# EAGLE design Pendulum Lamp PCB (EAGLE 8.6.0)

## Sheet 1 of 2
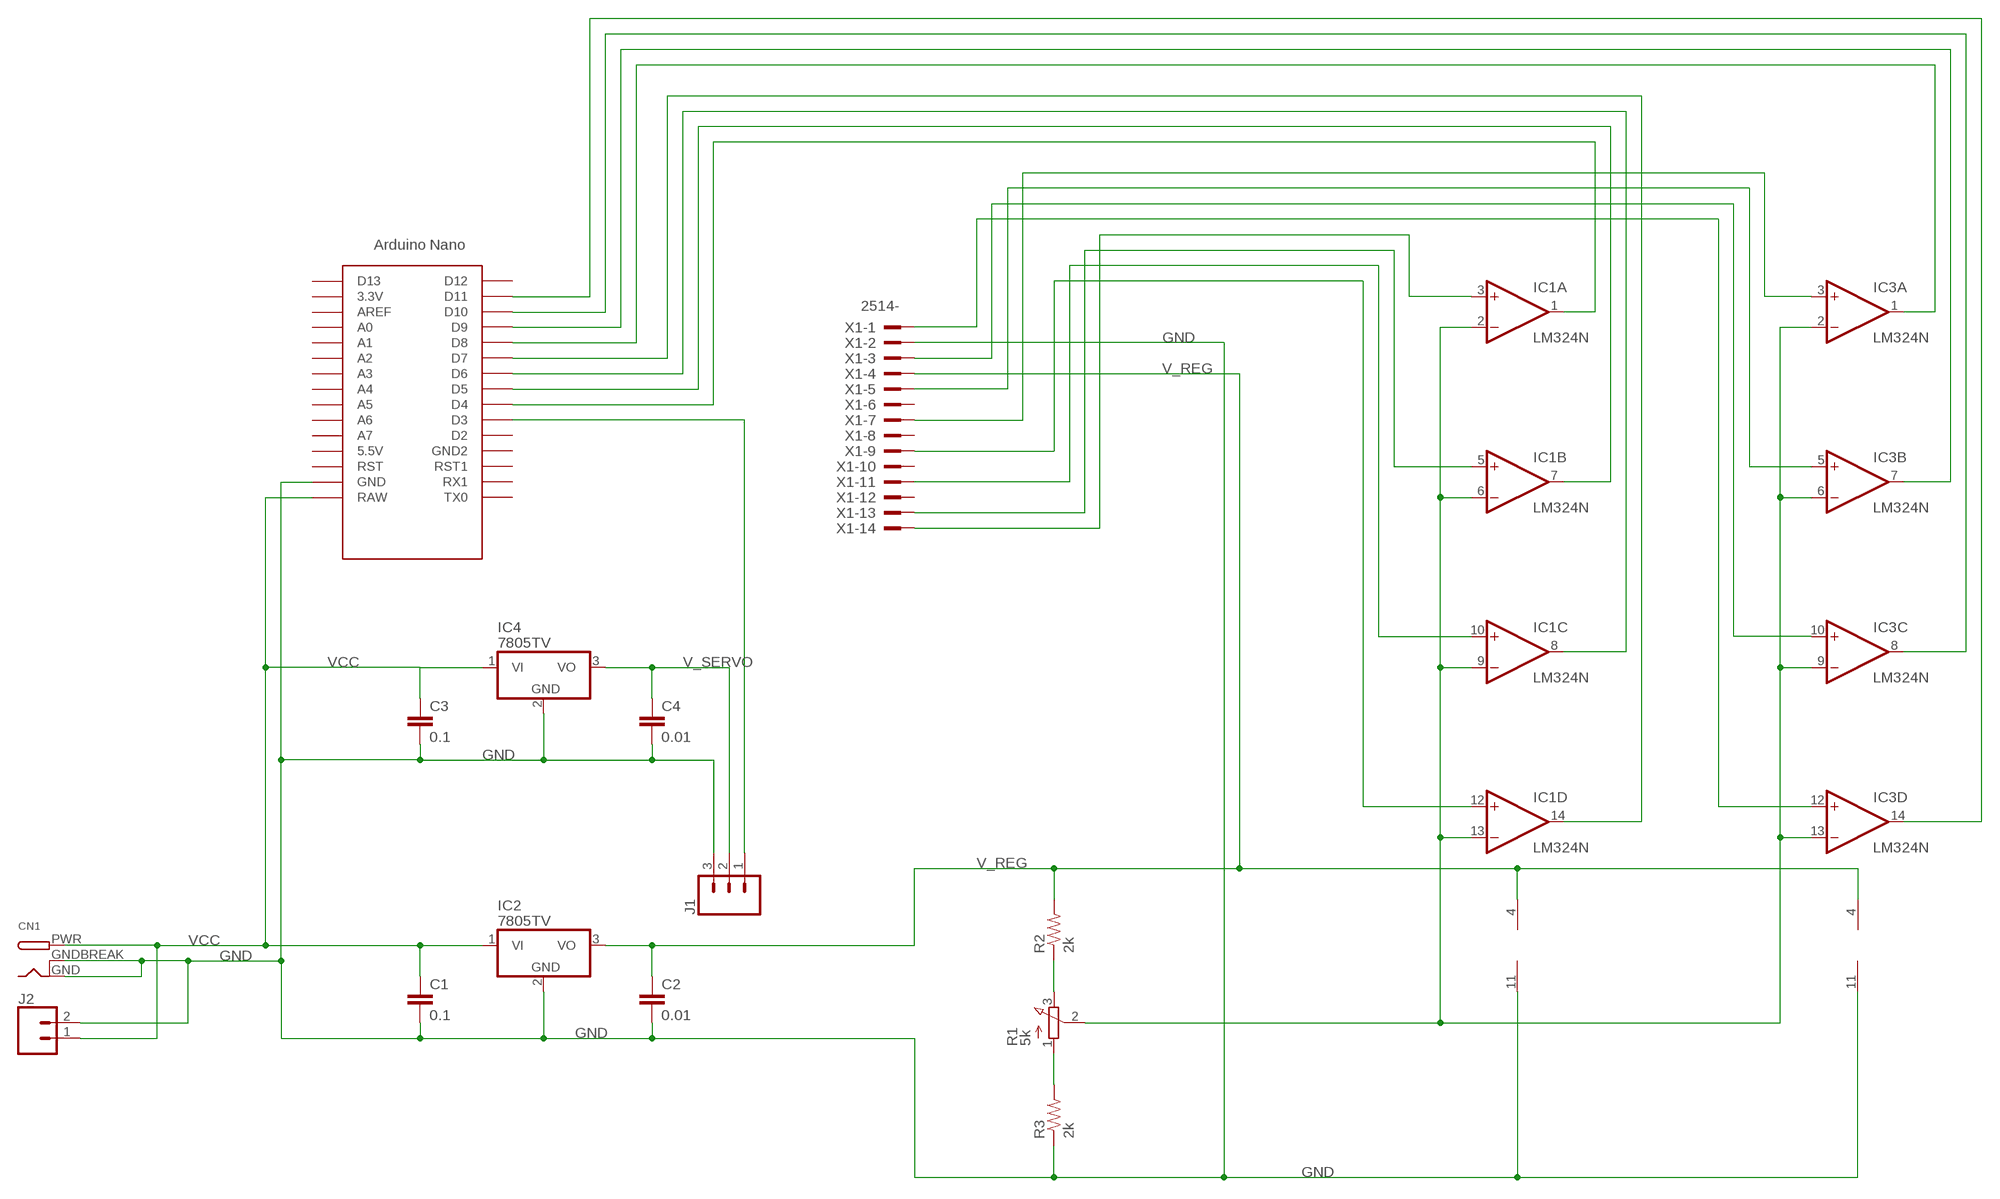
[diagram p0: schematic, sheet 1]

### Parts
C1  0.1  C-EU025-030X050  [C025-030X050]
C2  0.01  C-EU025-030X050  [C025-030X050]
C3  0.1  C-EU025-030X050  [C025-030X050]
C4  0.01  C-EU025-030X050  [C025-030X050]
CN1  DCBARRELPTH  [DCJACK_2MM_PTH]
IC1  LM324N  [DIL14]
IC2  7805TV  [TO220V]
IC3  LM324N  [DIL14]
IC4  7805TV  [TO220V]
J1  CONN_03LONGPADS  [1X03_LONGPADS]
J2  CONN_023.5MM_LOCK  [SCREWTERMINAL-3.5MM-2_LOCK]
R1  5k  3RP/1610N  [3RP/1610N]
R2  2k  R-US_0204/7  [0204/7]
R3  2k  R-US_0204/7  [0204/7]
U$1  NANO  [NANO]
X1  2514-  [PAK100/2500-14]

### Nets
GND: C1.2 C2.2 C3.2 C4.2 CN1.GND CN1.GNDBREAK IC1.11(P:V-) IC2.2(GND) IC3.11(P:V-) IC4.2(GND) J1.3 J2.2 R3.1 U$1.GND X1.2
N$1: IC1.3(A:+IN) X1.14
N$2: IC3.5(B:+IN) X1.5
N$3: J1.1 U$1.D3
N$4: IC3.10(C:+IN) X1.3
N$5: R1.1(A) R3.2
N$6: R1.3(E) R2.1
N$7: IC1.2(A:-IN) IC1.6(B:-IN) IC1.9(C:-IN) IC1.13(D:-IN) IC3.2(A:-IN) IC3.6(B:-IN) IC3.9(C:-IN) IC3.13(D:-IN) R1.2(S)
N$8: IC1.1(A:OUT) U$1.D4
N$9: IC1.7(B:OUT) U$1.D5
N$10: IC1.8(C:OUT) U$1.D6
N$11: IC1.14(D:OUT) U$1.D7
N$12: IC3.1(A:OUT) U$1.D8
N$13: IC3.7(B:OUT) U$1.D9
N$14: IC3.8(C:OUT) U$1.D10
N$15: IC3.14(D:OUT) U$1.D11
N$16: IC3.12(D:+IN) X1.1
N$17: IC1.12(D:+IN) X1.9
N$18: IC1.5(B:+IN) X1.13
N$19: IC1.10(C:+IN) X1.11
N$21: IC3.3(A:+IN) X1.7
V_REG: C2.1 IC1.4(P:V+) IC2.3(VO) IC3.4(P:V+) R2.2 X1.4
V_SERVO: C4.1 IC4.3(VO) J1.2
VCC: C1.1 C3.1 CN1.PWR IC2.1(VI) IC4.1(VI) J2.1 U$1.RAW
Unconnected: U$1.3.3V U$1.5V(5.5V) U$1.A0 U$1.A1 U$1.A2 U$1.A3 U$1.A4 U$1.A5 U$1.A6 U$1.A7 U$1.AREF U$1.D2 U$1.D12 U$1.D13 U$1.GND1(GND2) U$1.ICSP1 U$1.ICSP2 U$1.ICSP3 U$1.ICSP4 U$1.ICSP5 U$1.ICSP6 U$1.RST U$1.RST1 U$1.RX1 U$1.TX0 X1.6 X1.8 X1.10 X1.12

## Sheet 2 of 2
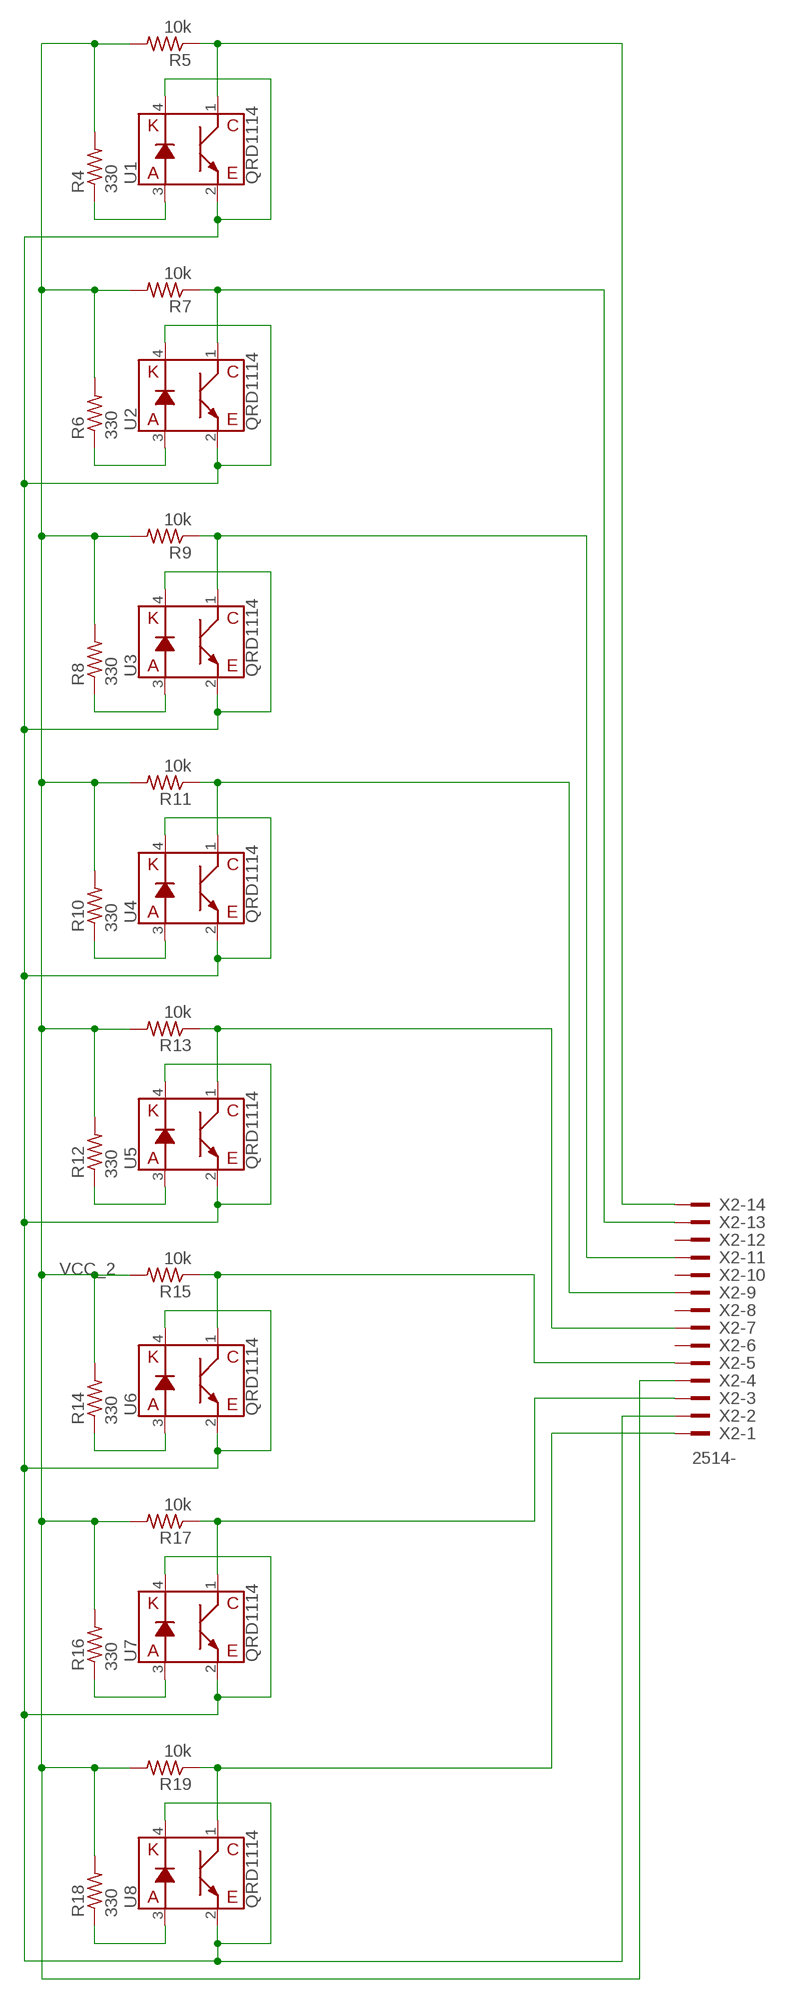
[diagram p1: schematic, sheet 2]

### Parts
R4  330  R-US_0204/7  [0204/7]
R5  10k  R-US_0204/7  [0204/7]
R6  330  R-US_0204/7  [0204/7]
R7  10k  R-US_0204/7  [0204/7]
R8  330  R-US_0204/7  [0204/7]
R9  10k  R-US_0204/7  [0204/7]
R10  330  R-US_0204/7  [0204/7]
R11  10k  R-US_0204/7  [0204/7]
R12  330  R-US_0204/7  [0204/7]
R13  10k  R-US_0204/7  [0204/7]
R14  330  R-US_0204/7  [0204/7]
R15  10k  R-US_0204/7  [0204/7]
R16  330  R-US_0204/7  [0204/7]
R17  10k  R-US_0204/7  [0204/7]
R18  330  R-US_0204/7  [0204/7]
R19  10k  R-US_0204/7  [0204/7]
U1  QRD1114  [QRD1114]
U2  QRD1114  [QRD1114]
U3  QRD1114  [QRD1114]
U4  QRD1114  [QRD1114]
U5  QRD1114  [QRD1114]
U6  QRD1114  [QRD1114]
U7  QRD1114  [QRD1114]
U8  QRD1114  [QRD1114]
X2  2514-  [PAK100/2500-14]

### Nets
GND_2: U1.2(E) U1.4(K) U2.2(E) U2.4(K) U3.2(E) U3.4(K) U4.2(E) U4.4(K) U5.2(E) U5.4(K) U6.2(E) U6.4(K) U7.2(E) U7.4(K) U8.2(E) U8.4(K) X2.2
N$30: R4.1 U1.3(A)
N$31: R5.1 U1.1(C) X2.14
N$34: R6.1 U2.3(A)
N$36: R7.1 U2.1(C) X2.13
N$38: R8.1 U3.3(A)
N$40: R9.1 U3.1(C) X2.11
N$42: R10.1 U4.3(A)
N$44: R11.1 U4.1(C) X2.9
N$46: R12.1 U5.3(A)
N$48: R13.1 U5.1(C) X2.7
N$50: R14.1 U6.3(A)
N$52: R15.1 U6.1(C) X2.5
N$54: R16.1 U7.3(A)
N$56: R17.1 U7.1(C) X2.3
N$58: R18.1 U8.3(A)
N$60: R19.1 U8.1(C) X2.1
VCC_2: R4.2 R5.2 R6.2 R7.2 R8.2 R9.2 R10.2 R11.2 R12.2 R13.2 R14.2 R15.2 R16.2 R17.2 R18.2 R19.2 X2.4
Unconnected: X2.6 X2.8 X2.10 X2.12

## Library data of the parts
C1-C4 = rcl:C-EU: CAPACITOR, European symbol; SPICEPREFIX: C
CN1 = adafruit:DCBARREL: 2.0mm DC Barrel Jack DCJACK_2MM_PTH - Through Hole Jack (4UConnector: 05537)
IC1 IC3 = linear:LM324: OP AMP
IC2 IC4 = linear:78*: Positive VOLTAGE REGULATOR Source: http://cache.national.com/ds/LM/LM78L05.pdf http://www.fairchildsemi.com/ds/LM/LM7805.pdf
J1 = SparkFun-Connectors:CONN_03: Multi connection point. Often used as Generic Header-pin footprint for 0.1 inch spaced/style header connections On any of the 0.1 inch spaced packages, you can populate with these: Break Away Headers - Straight <https://www.sparkfun.com/products/116> (PRT-00116) Break Away Male Headers - Right Angle <https://www.sparkfun.com/products/553> (PRT-00553) Female Headers <https://www.sparkfun.com/products/115> (PRT-00115) Break Away Headers - Machine Pin <https://www.sparkfun.com/products/117> (PRT-00117) Break Away Female Headers - Swiss Machine Pin <https://www.sparkfun.com/products/743> (PRT-00743) Stackable Header - 3 Pin (Female, 0.1") <https://www.sparkfun.com/products/13875> (PRT-13875) For SCREWTERMINALS and SPRING TERMINALS visit here: Screw Terimnals on SparkFun.com <https://www.sparkfun.com/search/results?term=Screw+Terminals> (5mm/3.5mm/2.54mm spacing) This device is also useful as a general connection point to wire up your design to another part of your project. Our various solder wires solder well into these plated through hole pads. Hook-Up Wire - Assortment (Stranded, 22 AWG) <https://www.sparkfun.com/products/11375> (PRT-11375) Hook-Up Wire - Assortment (Solid Core, 22 AWG) <https://www.sparkfun.com/products/11367> (PRT-11367) View the entire wire category on our website here <https://www.sparkfun.com/categories/141> Special notes: Molex polarized connector foot print use with SKU : PRT-08232 with associated crimp pins and housings.
J2 = SparkFun-Connectors:CONN_02: Multi connection point. Often used as Generic Header-pin footprint for 0.1 inch spaced/style header connections On any of the 0.1 inch spaced packages, you can populate with these: Break Away Headers - Straight <https://www.sparkfun.com/products/116> (PRT-00116) Break Away Male Headers - Right Angle <https://www.sparkfun.com/products/553> (PRT-00553) Female Headers <https://www.sparkfun.com/products/115> (PRT-00115) Break Away Headers - Machine Pin <https://www.sparkfun.com/products/117> (PRT-00117) Break Away Female Headers - Swiss Machine Pin <https://www.sparkfun.com/products/743> (PRT-00743) For SCREWTERMINALS and SPRING TERMINALS visit here: Screw Terimnals on SparkFun.com <https://www.sparkfun.com/search/results?term=Screw+Terminals> (5mm/3.5mm/2.54mm spacing) This device is also useful as a general connection point to wire up your design to another part of your project. Our various solder wires solder well into these plated through hole pads. Hook-Up Wire - Assortment (Stranded, 22 AWG) <https://www.sparkfun.com/products/11375> (PRT-11375) Hook-Up Wire - Assortment (Solid Core, 22 AWG) <https://www.sparkfun.com/products/11367> (PRT-11367) View the entire wire category on our website here <https://www.sparkfun.com/categories/141> Special notes: Molex polarized connector foot print use with: PRT-08233 with associated crimp pins and housings. 2.54_SCREWTERM for use with PRT-10571. 3.5mm Screw Terminal footprints for PRT-08084 5mm Screw Terminal footprints for use with PRT-08432; PROD_ID: CONN-08399
R1 = pot:3RP/1610N: 16mm Potentiometer one level Source: http://www.alphapotentiometers.net/html/16mm_pot_2.html
R2-R19 = rcl:R-US_: RESISTOR, American symbol; SPICEPREFIX: R
U1-U8 = SparkFun-Sensors:QRD1114: QRD1114 Reflective Proximity, Object Sensor This sensor uses an infrared emitted diode combined with an infrared phototransistor to detect the reflected infrared signal. Ideal for sensing black-to-white transitions or can be used to detect nearby objects (.5-1cm). Datasheet <http://www.sparkfun.com/datasheets/BOT/QRD1114.pdf> SparkFun Products Optical Detector / Phototransistor - QRD1114 <https://www.sparkfun.com/products/246> (SEN-00246); PROD_ID: IC-09032; SF_ID: SEN-00246
U$1 = Arduino-clone:NANO: Arduino Nano
X1 X2 = con-3m:2514-: 3M (TM) Pak 100 4-Wall Header Source: 3M; OC_FARNELL: unknown; OC_NEWARK: unknown

## Board
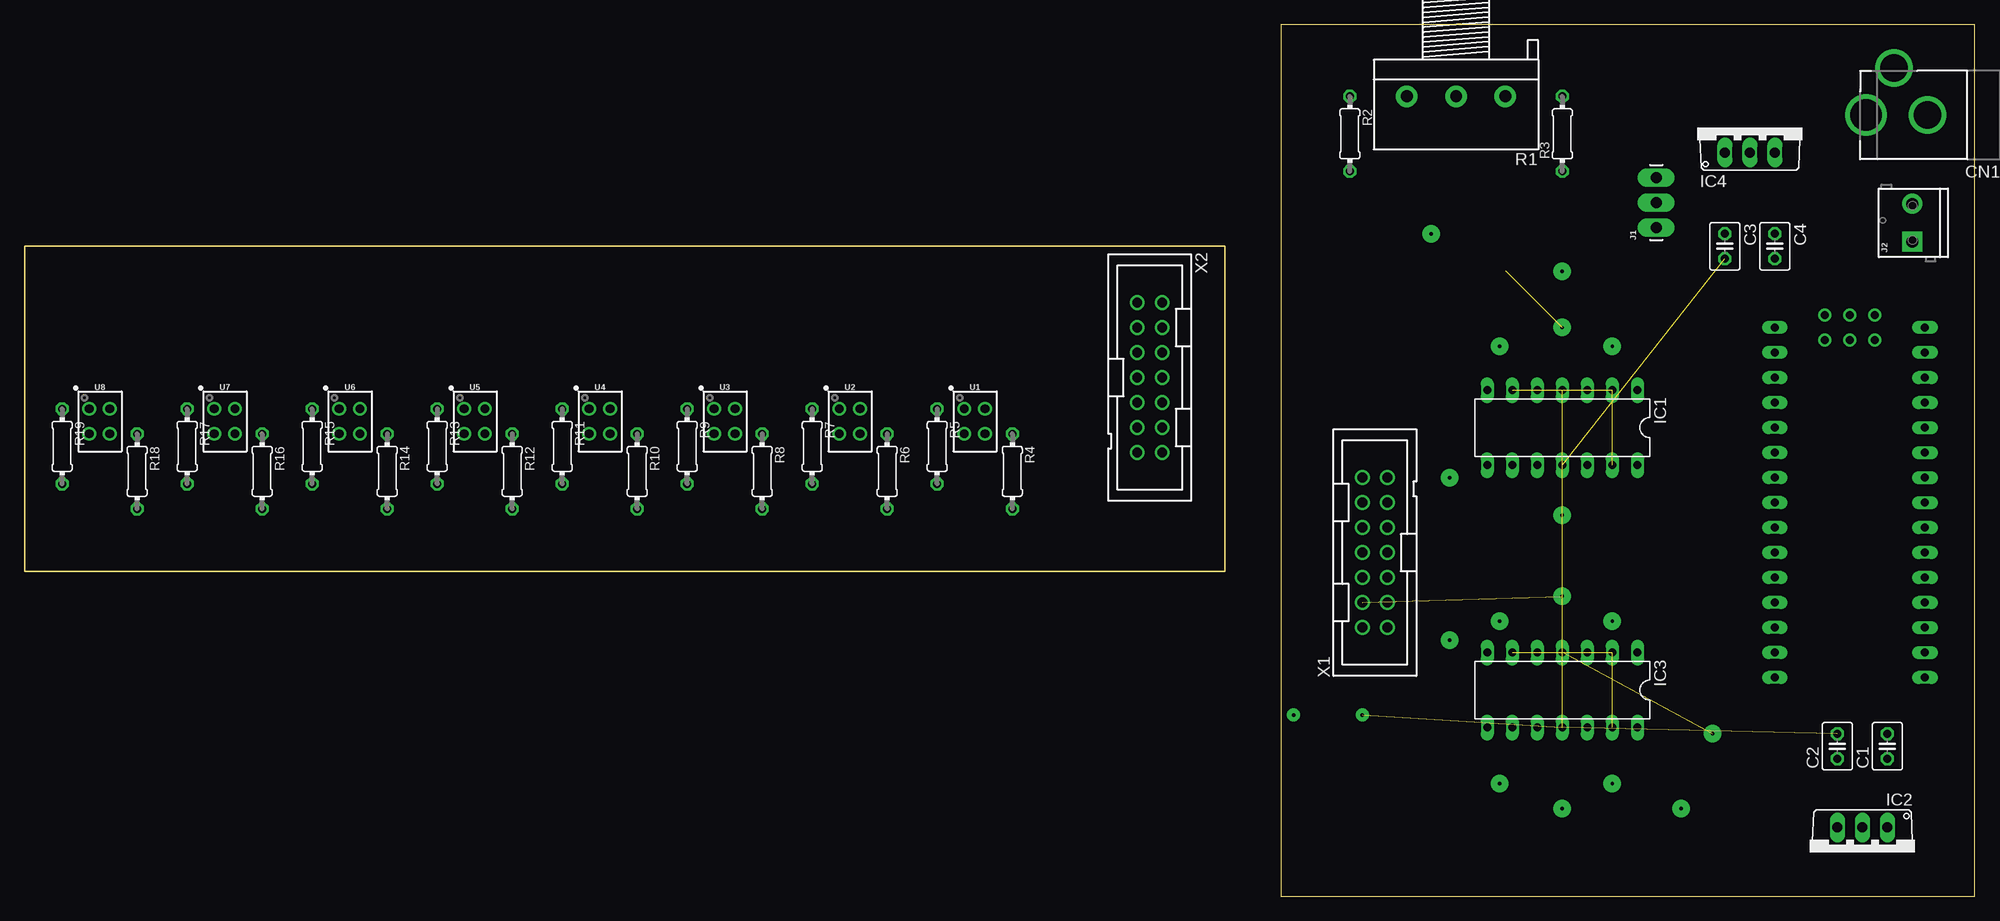
[diagram p2: board, top side]
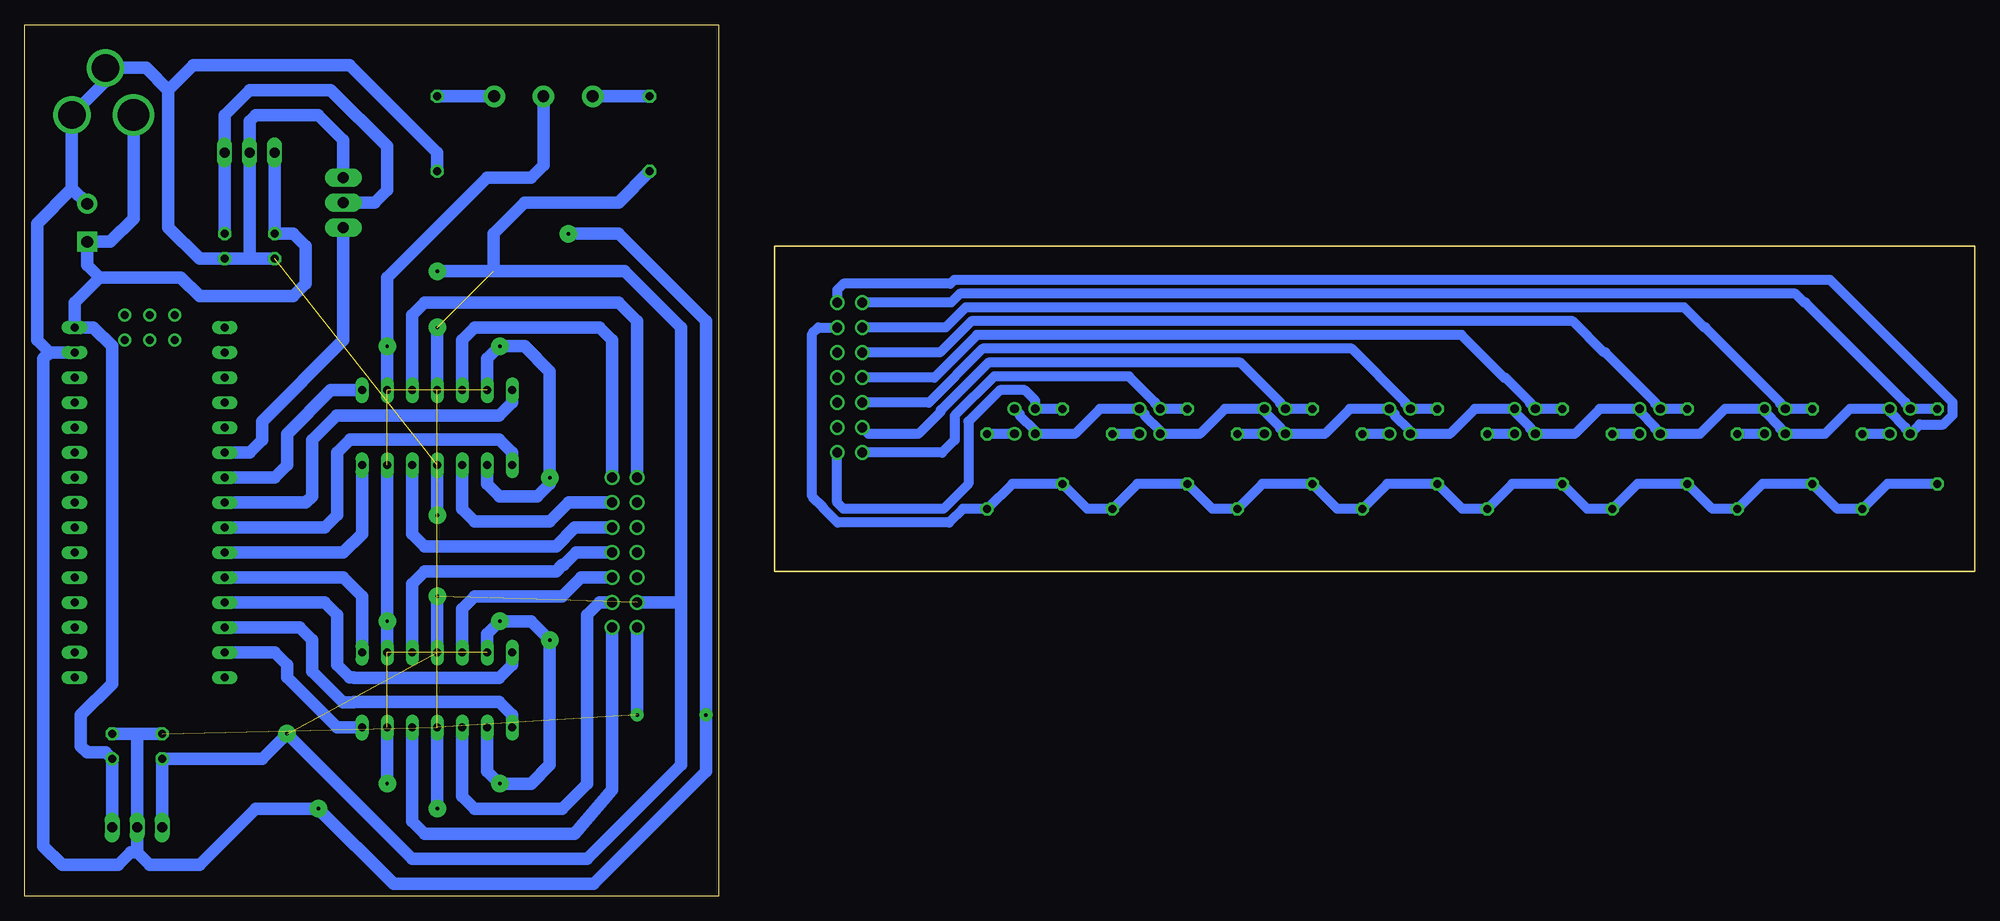
[diagram p3: board, bottom side, seen from below]

Size 198.1 x 88.57 mm. Coordinates in mm from the lower left corner, seen from the top.
Outline: 127.64,0 198.1,0 198.1,88.57 127.64,88.57 127.64,0
Outline: 0,33.02 121.92,33.02 121.92,66.04 0,66.04 0,33.02
Copper layers (1*16): Top 0.035mm / dielectric 1.5mm / Bottom 0.035mm
Design rules "default *": minimum track width 6mil, minimum drill 0.35mm, track to track 15mil, track to pad 15mil, pad to pad 15mil, via to via 15mil, smd to smd 15mil, copper to edge 40mil, drill to drill 6mil, minimum pad ring 10mil, minimum via ring 8mil, stop-mask expansion 4mil, vias tented up to drill 0mil, thermal gap 10mil

### Footprints (pad centres in the part's own frame; a part is rotated, then mirrored left to right if it is on the bottom)
C025-030X050 = drill 0.813 octagon: 1 -1.27,0; 2 1.27,0
DCJACK_2MM_PTH = drill 2.8: GND 0,7.35; GNDBREAK 4.8,10.75 | drill 3.2: PWR 0,13.6
DIL14 = drill 0.813 long: 1 -7.62,-3.81; 2 -5.08,-3.81; 3 -2.54,-3.81; 4 0,-3.81; 5 2.54,-3.81; 6 5.08,-3.81; 7 7.62,-3.81; 8 7.62,3.81; 9 5.08,3.81; 10 2.54,3.81; 11 0,3.81; 12 -2.54,3.81; 13 -5.08,3.81; 14 -7.62,3.81
TO220V = drill 1.016 long: 1 -2.54,-2.54; 2 0,-2.54; 3 2.54,-2.54
1X03_LONGPADS = drill 1.118 pad 1.88 long: 1 0,0; 2 2.54,0; 3 5.08,0
SCREWTERMINAL-3.5MM-2_LOCK = drill 1.2 pad 2.032 square: 1 -0.178,0 | drill 1.2 pad 2.032: 2 3.678,0
3RP/1610N = drill 1.2 pad 2.184: 1 -5,0; 2 0,0; 3 5,0
0204/7 = drill 0.813 octagon: 1 -3.81,0; 2 3.81,0
QRD1114 = drill 0.9: 1 -1.067,1.27; 2 -1.067,-1.27; 3 1.041,-1.27; 4 1.041,1.27
NANO = drill 0.8 long: 3.3V -10.16,24.13; 5V -10.16,-1.27; A0 -10.16,19.05; A1 -10.16,16.51; A2 -10.16,13.97; A3 -10.16,11.43; A4 -10.16,8.89; A5 -10.16,6.35; A6 -10.16,3.81; A7 -10.16,1.27; AREF -10.16,21.59; D2 5.08,1.27; D3 5.08,3.81; D4 5.08,6.35; D5 5.08,8.89; D6 5.08,11.43; D7 5.08,13.97; D8 5.08,16.51; D9 5.08,19.05; D10 5.08,21.59; D11 5.08,24.13; D12 5.08,26.67; D13 -10.16,26.67; GND -10.16,-6.35; GND1 5.08,-1.27; RAW -10.16,-8.89; RST -10.16,-3.81; RST1 5.08,-3.81; RX1 5.08,-6.35; TX0 5.08,-8.89 | drill 0.8: ICSP1 -5.08,-10.16; ICSP2 -5.08,-7.62; ICSP3 -2.54,-10.16; ICSP4 -2.54,-7.62; ICSP5 0,-10.16; ICSP6 0,-7.62
PAK100/2500-14 = drill 1 pad 1.422: 1 -7.62,-1.27; 2 -7.62,1.27; 3 -5.08,-1.27; 4 -5.08,1.27; 5 -2.54,-1.27; 6 -2.54,1.27; 7 0,-1.27; 8 0,1.27; 9 2.54,-1.27; 10 2.54,1.27; 11 5.08,-1.27; 12 5.08,1.27; 13 7.62,-1.27; 14 7.62,1.27

### Placement (x,y rotation side)
C1  189.23,15.24 90 top
C2  184.15,15.24 90 top
C3  172.72,66.04 270 top
C4  177.8,66.04 270 top
CN1  200.66,79.38 90 top
IC1  156.21,47.62 180 top
IC2  186.69,4.45 180 top
IC3  156.21,20.96 180 top
IC4  175.26,78.11 0 top
J1  165.74,67.94 90 top
J2  191.77,66.68 90 top
R1  145.42,81.28 180 top
R2  134.62,77.47 270 top
R3  156.21,77.47 90 top
R4  100.33,43.18 270 top
R5  92.71,45.72 270 top
R6  87.63,43.18 270 top
R7  80.01,45.72 270 top
R8  74.93,43.18 270 top
R9  67.31,45.72 270 top
R10  62.23,43.18 270 top
R11  54.61,45.72 270 top
R12  49.53,43.18 270 top
R13  41.91,45.72 270 top
R14  36.83,43.18 270 top
R15  29.21,45.72 270 top
R16  24.13,43.18 270 top
R17  16.51,45.72 270 top
R18  11.43,43.18 270 top
R19  3.81,45.72 270 top
U1  96.52,48.26 0 top
U2  83.82,48.26 0 top
U3  71.12,48.26 0 top
U4  58.42,48.26 0 top
U5  45.72,48.26 0 top
U6  33.02,48.26 0 top
U7  20.32,48.26 0 top
U8  7.62,48.26 0 top
U$1  182.88,48.9 180 top
X1  137.16,34.93 90 top
X2  114.3,52.71 270 top

### Tracks (layer width: path | path; a pad name or v marks a point on that pad's centre or on a via)
GND  (via drill 0.35 pad 1.3, 0.35 pad 1.78)  (4 unrouted)
  Bottom 1.27: C3.2 175.26,64.77 | 175.26,64.77 C4.2 180.34,64.77 183.51,67.94 183.51,81.91 | 175.26,64.77 IC4.2 175.26,78.74 174.62,79.38 168.27,79.38 165.74,76.84 J1.3 | J2.2 193.31,71.89 | 193.31,71.89 CN1.GND 189.91,82.78 CN1.GNDBREAK 185.77,84.18 183.51,81.91 | U$1.GND 195.58,55.24 196.85,56.51 196.85,68.35 193.31,71.89 | IC2.2 186.69,16.51 | 186.69,16.51 C1.2 | 186.69,16.51 C2.2 | IC3.11 156.21,8.89 | IC1.11 v156.21,38.73 | R3.1 156.21,75.56 165.1,84.46 180.98,84.46 183.51,81.91 | X1.2 v135.89,18.41
GND_2
  Bottom 1.016: U1.4 97.05,49.01 97.05,48.87 95.45,47.28 U1.2 91.44,46.99 88.9,49.53 U2.4 84.35,49.01 84.35,48.87 82.75,47.28 U2.2 78.74,46.99 76.2,49.53 U3.4 72.16,49.24 70.57,47.65 70.57,47.51 U3.2 66.04,46.99 63.5,49.53 U4.4 58.95,49.01 58.95,48.87 57.35,47.28 U4.2 53.34,46.99 50.8,49.53 U5.4 46.76,49.24 45.17,47.65 45.17,47.51 U5.2 40.64,46.99 38.1,49.53 U6.4 34.06,49.24 32.47,47.65 32.47,47.51 U6.2 27.94,46.99 25.4,49.53 U7.4 21.36,49.24 19.77,47.65 19.77,47.51 U7.2 15.24,46.99 12.7,49.53 U8.4 8.66,49.24 7.07,47.65 7.07,47.51 U8.2 5.61,47.94 3.21,47.94 2.26,48.89 2.26,50.17 14.7,62.61 103.69,62.61 104.07,62.23 114.93,62.23 115.57,61.59 X2.2
N$1
  Bottom 1.27: X1.14 135.89,58.42 137.8,60.32 157.48,60.32 158.75,59.05 IC1.3
N$2
  Bottom 1.27: IC3.5 153.67,29.21 152.4,30.48 143.51,30.48 141.61,32.38 X1.5
N$3
  Bottom 1.27: J1.1 165.74,56.51 173.99,48.26 173.99,46.35 175.26,45.09 U$1.D3
N$4
  Bottom 1.27: X1.3 139.7,29.84 140.97,28.57 140.97,11.43 143.51,8.89 152.4,8.89 153.67,10.16 IC3.10
N$5
  Bottom 1.27: R1.1 R3.2
N$6
  Bottom 1.27: R1.3 R2.1
N$7  (via drill 0.35 pad 1.78)  (4 unrouted)
  Bottom 1.27: IC3.2 v161.29,27.94 IC1.13 | IC3.6 151.13,26.67 v149.86,27.94 146.69,27.94 v144.78,26.04 144.78,13.34 146.69,11.43 v149.86,11.43 151.13,12.7 IC3.9 | IC1.9 151.13,41.91 149.86,40.64 146.05,40.64 144.78,41.91 v144.78,42.54 144.78,53.34 147.32,55.88 v149.86,55.88 151.13,54.61 IC1.6 | IC3.13 161.29,11.43 | R1.2 145.42,74.3 146.69,73.03 151.13,73.03 161.29,62.87 IC1.2
N$8
  Bottom 1.27: U$1.D4 172.72,42.54 171.45,43.82 171.45,46.99 167,51.43 IC1.1
N$9
  Bottom 1.27: U$1.D5 169.55,40.01 168.91,40.64 168.91,46.35 166.42,48.84 149.91,48.84 148.59,50.16 IC1.7
N$10
  Bottom 1.27: IC1.8 148.59,45.09 149.91,46.41 165.05,46.41 166.37,45.09 166.37,38.73 167.64,37.46 U$1.D6
N$11
  Bottom 1.27: IC1.14 163.83,36.83 165.74,34.93 U$1.D7
N$12
  Bottom 1.27: IC3.1 163.83,30.48 165.74,32.38 U$1.D8
N$13
  Bottom 1.27: U$1.D9 167.64,29.84 166.37,28.57 166.37,23.49 165.1,22.23 164.68,22.23 164.63,22.17 149.91,22.17 148.59,23.49 IC3.7
N$14
  Bottom 1.27: IC3.8 148.59,18.41 149.91,19.74 164.63,19.74 164.68,19.68 165.74,19.68 168.91,22.86 168.91,26.04 170.18,27.3 U$1.D10
N$15
  Bottom 1.27: IC3.14 166.37,17.15 171.45,22.23 171.45,23.49 172.72,24.76 U$1.D11
N$16
  Bottom 1.27: X1.1 138.43,10.79 142.24,6.35 157.48,6.35 158.75,7.62 IC3.12
N$17
  Bottom 1.27: IC1.12 158.75,36.83 157.48,35.56 144.14,35.56 142.24,37.46 X1.9
N$18
  Bottom 1.27: IC1.5 153.67,56.51 152.4,57.79 139.7,57.79 138.43,56.51 X1.13
N$19
  Bottom 1.27: IC1.10 153.67,39.37 152.4,38.1 144.78,38.1 142.88,40.01 X1.11
N$20  (via drill 0.35 pad 1.78)
  other vias: 161.29,55.88
N$21
  Bottom 1.27: X1.7 142.09,34.93 143.36,33.65 143.51,33.65 144.14,33.02 157.48,33.02 158.75,31.75 IC3.3
N$22  (via drill 0.35 pad 1.78)
  other vias: 161.29,11.43
N$23  (via drill 0.35 pad 1.78)
  other vias: 156.21,30.48
N$24  (via drill 0.35 pad 1.78)
  other vias: 156.21,8.89
N$25  (via drill 0.35 pad 1.3, 0.35 pad 1.78)
  Bottom 1.27: 186.69,4.45 185.42,3.17 180.34,3.17 174.62,8.89 v168.27,8.89 160.65,1.27 140.33,1.27 128.9,12.7 v128.9,18.41 128.9,58.42 137.8,67.31 142.88,67.31 | 186.69,4.45 186.69,6.98 | 186.69,4.45 187.32,4.45 188.59,3.17 194.31,3.17 196.21,5.08 196.21,54.61 195.58,55.24
N$26  (via drill 0.35 pad 1.78)
  other vias: 171.45,16.51
N$27  (via drill 0.35 pad 1.78)
  other vias: 156.21,57.79
N$28  (via drill 0.35 pad 1.78)
  Bottom 1.27: v156.21,63.5 137.16,63.5 131.44,57.79 131.44,13.34 140.97,3.81 158.75,3.81 171.45,16.51
N$29  (via drill 0.35 pad 1.78)
  other vias: 142.88,67.31
N$30
  Bottom 1.016: U1.3 R4.1
N$31
  Bottom 1.016: R5.1 U1.1 95.45,50.37 96.52,51.43 99.06,51.43 102.23,48.26 102.23,41.91 104.77,39.37 114.93,39.37 115.57,40.01 X2.14
N$34
  Bottom 1.016: U2.3 R6.1
N$36
  Bottom 1.016: R7.1 U2.1 83.27,50.04 83.27,50.19 85.91,52.83 99.64,52.83 103.63,48.84 103.63,46.35 104.9,45.09 X2.13
N$38
  Bottom 1.016: U3.3 R8.1
N$40
  Bottom 1.016: R9.1 U3.1 70.57,50.04 70.57,50.19 74.61,54.23 100.22,54.23 105.03,49.42 105.03,49.28 107.32,46.99 112.39,46.99 X2.11
N$42
  Bottom 1.016: U4.3 R10.1
N$44
  Bottom 1.016: R11.1 U4.1 57.87,50.04 57.87,50.19 63.3,55.63 100.8,55.63 106.26,50.16 X2.9
N$46
  Bottom 1.016: U5.3 R12.1
N$48
  Bottom 1.016: R13.1 U5.1 45.17,50.04 45.17,50.19 47.68,52.71 47.83,52.71 52.15,57.02 101.37,57.02 105.69,52.71 X2.7
N$50
  Bottom 1.016: U6.3 R14.1
N$52
  Bottom 1.016: R15.1 U6.1 32.47,50.04 32.47,50.19 37.52,55.24 37.67,55.24 40.84,58.42 101.95,58.42 105.13,55.24 X2.5
N$54
  Bottom 1.016: U7.3 R16.1
N$56
  Bottom 1.016: R17.1 U7.1 19.77,50.04 19.77,50.19 27.36,57.79 27.51,57.79 29.54,59.82 102.53,59.82 104.56,57.79 X2.3
N$58
  Bottom 1.016: U8.3 R18.1
N$60
  Bottom 1.016: R19.1 U8.1 7.07,50.04 7.07,50.19 17.2,60.32 17.35,60.32 18.24,61.21 103.11,61.21 104,60.32 X2.1
V_REG  (4 unrouted)
  Bottom 1.27: IC2.3 C2.1 173.99,13.97 171.45,16.51 | IC3.4 156.21,30.48 | IC1.4 156.21,57.79 | R2.2 137.8,70.48 147.32,70.48 150.5,67.31 150.5,63.5 | X1.4 132.08,29.84
V_SERVO
  Bottom 1.27: C4.1 IC4.3 177.8,79.38 175.26,81.91 167,81.91 161.29,76.2 161.29,71.75 162.56,70.48 J1.2
VCC
  Bottom 1.27: IC4.1 C3.1 170.81,67.31 169.55,66.04 169.55,62.23 170.81,60.96 180.34,60.96 182.25,62.87 190.5,62.87 | 190.5,62.87 193.04,60.32 U$1.RAW 191.13,57.79 189.23,55.88 189.23,21.59 192.4,18.41 192.4,15.24 191.77,14.6 189.87,14.6 C1.1 IC2.1 | 190.5,62.87 191.77,64.13 J2.1 189.41,66.5 187.06,68.84 CN1.PWR
VCC_2
  Bottom 1.016: R19.2 8.89,41.91 R18.2 13.97,39.37 R17.2 21.59,41.91 R16.2 26.67,39.37 R15.2 34.29,41.91 R14.2 39.37,39.37 R13.2 46.99,41.91 R12.2 52.07,39.37 R11.2 59.69,41.91 R10.2 64.77,39.37 R9.2 72.39,41.91 R8.2 77.47,39.37 R7.2 85.09,41.91 R6.2 90.17,39.37 R5.2 97.79,41.91 R4.2 102.8,39.37 104.2,37.97 115.51,37.97 116.97,39.43 116.97,39.5 118.11,40.64 118.11,57.15 117.48,57.79 X2.4